# EAGLE schematic BT-2 (EAGLE 9.6.2)
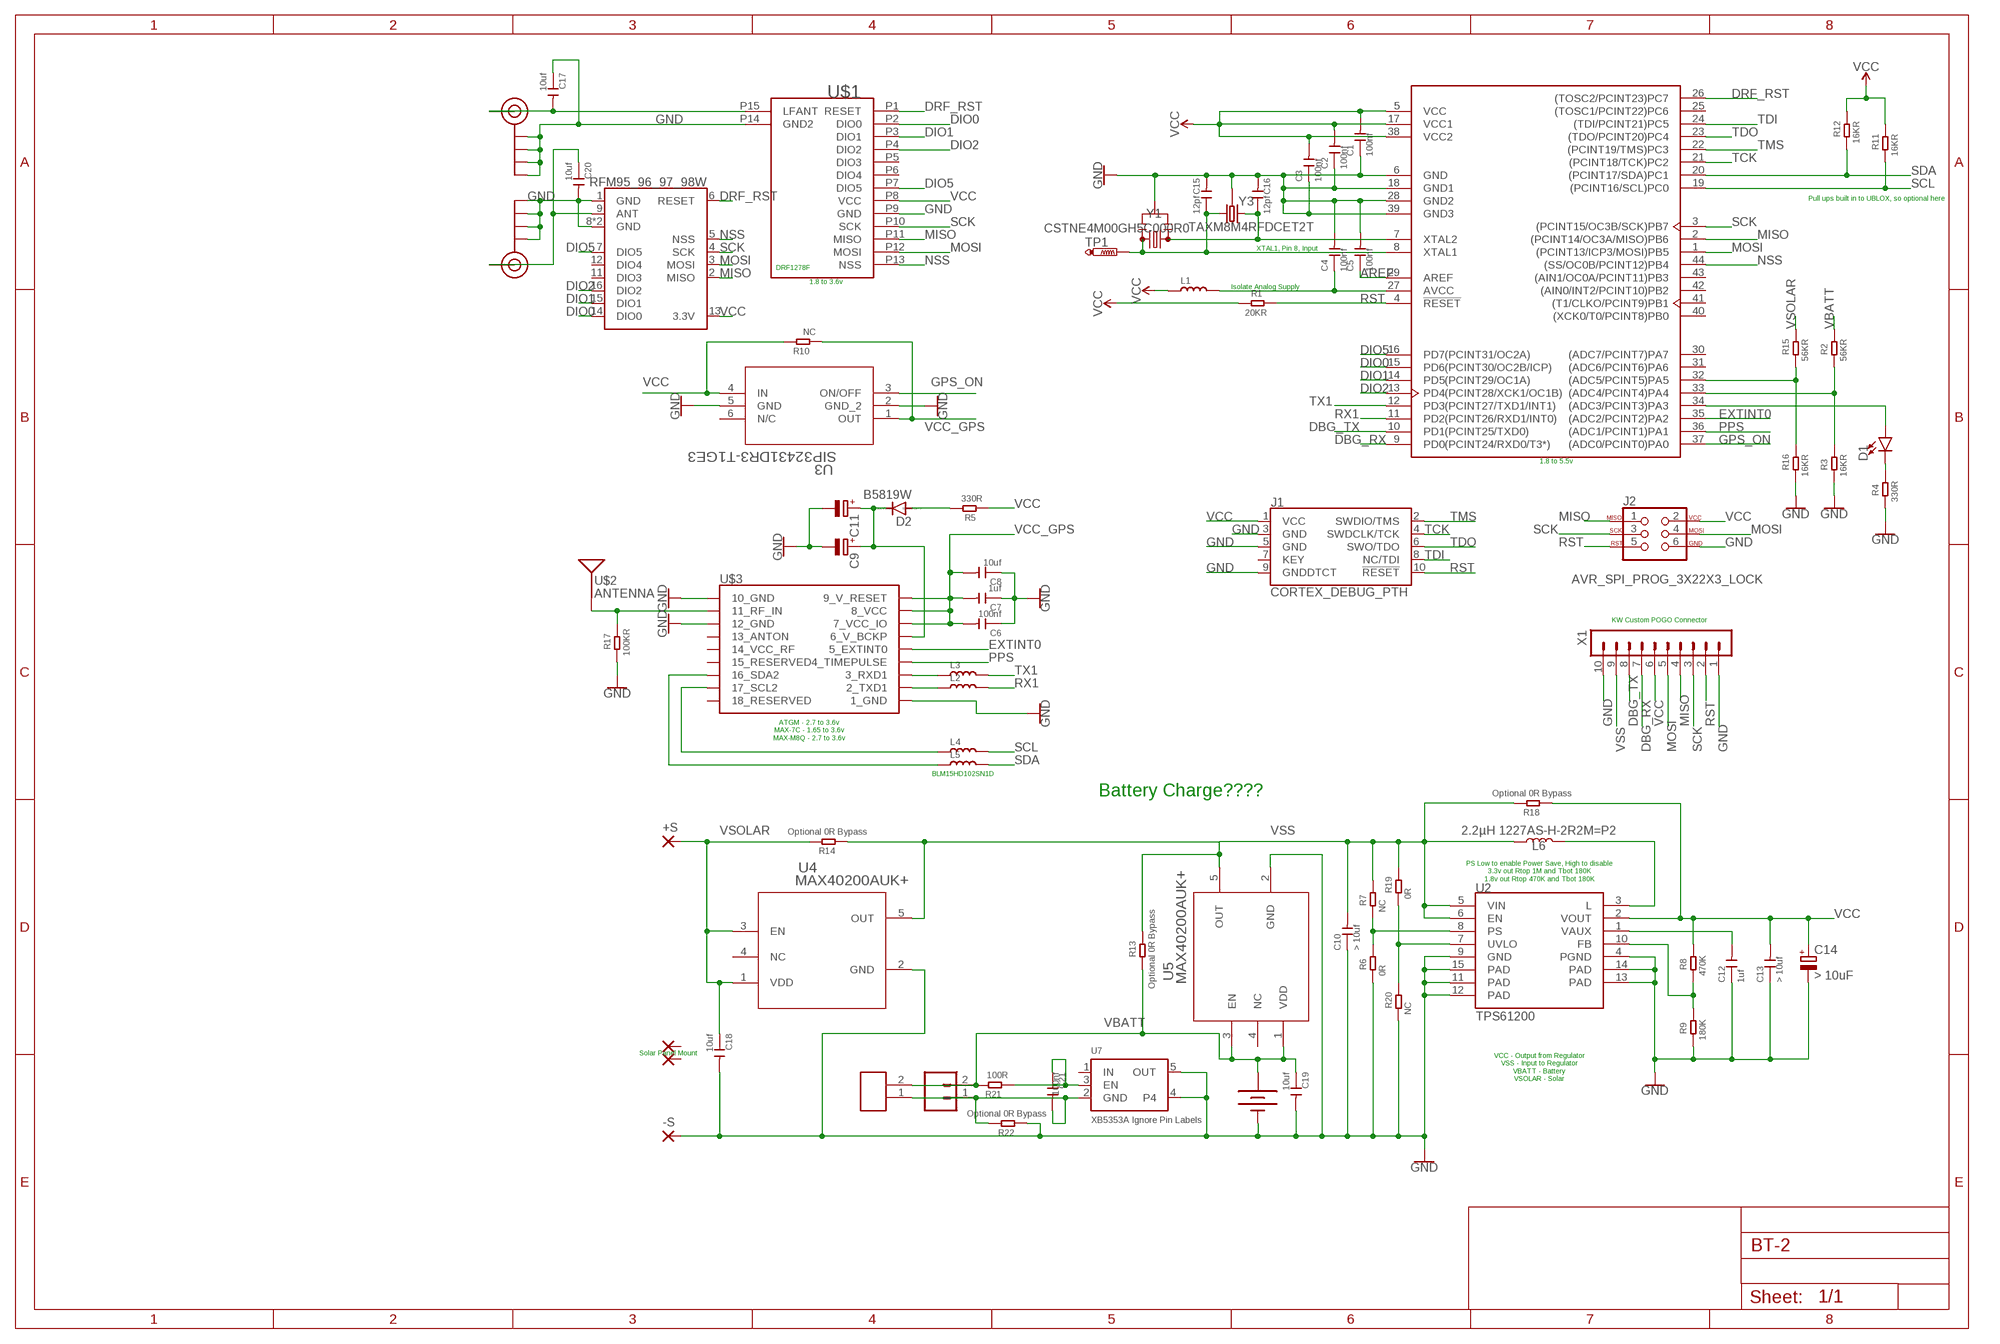
[diagram p0: schematic, sheet 1]

## Parts
+S  SMD2  [SMD1,27-2,54]
-S  SMD2  [SMD1,27-2,54]
BT1  BATTERY  [BATTERY-AA-AAA]
C1  100nf  CERAMIC-100NF-25V-10%-X7R(0402)  [C0402]
C2  100nf  CERAMIC-100NF-25V-10%-X7R(0402)  [C0402]
C3  100nf  CERAMIC-100NF-25V-10%-X7R(0402)  [C0402]
C4  100nf  CERAMIC-100NF-25V-10%-X7R(0402)  [C0402]
C5  100nf  CERAMIC-100NF-25V-10%-X7R(0402)  [C0402]
C6  100nf  CERAMIC-100NF-25V-10%-X7R(0402)  [C0402]
C7  1uf  CERAMIC-1UF-10V-10%-X5R(0402)  [C0402]
C8  10uf  CERAMIC-10UF-6.3V-20%-X5R(0402)  [C0402]
C9  RCL_CPOL-EUSMCC  [RCL_SMC_C]
C10  > 10uf  CERAMIC-10UF-10V-10%-X5R(0603)  [C0603]
C11  C-POL_ECAP-10.5MM  [CAPAE1030X1050N]
C12  1uf  CERAMIC-1UF-10V-10%-X5R(0402)  [C0402]
C13  > 10uf  CERAMIC-10UF-10V-10%-X5R(0603)  [C0603]
C14  > 10uF  RCL_CPOL-EUSMCC  [RCL_SMC_C]
C15  12pf  CERAMIC-100NF-25V-10%-X7R(0402)  [C0402]
C16  12pf  CERAMIC-100NF-25V-10%-X7R(0402)  [C0402]
C17  10uf  CERAMIC-10UF-6.3V-20%-X5R(0402)  [C0402]
C18  10uf  CERAMIC-10UF-6.3V-20%-X5R(0402)  [C0402]
C19  10uf  CERAMIC-10UF-6.3V-20%-X5R(0402)  [C0402]
C20  10uf  CERAMIC-10UF-6.3V-20%-X5R(0402)  [C0402]
C21  100nf  CERAMIC-100NF-25V-10%-X7R(0402)  [C0402]
D1  LED0603  [LED-0603]
D2  B5819W  DIODE-SOD123  [SOD123]
J1  CORTEX_DEBUG_PTH  [2X5-PTH-1.27MM]
J2  AVR_SPI_PROG_3X22X3_LOCK  [2X3_LOCK]
J3  JST_ZH_2PIN  [JST_ZH_2PIN]
J4  CONN_02JST-PTH-2-KIT  [JST-2-PTH-KIT]
J$1  SMA_EDGE  [SMA-EDGE]
J$2  SMA_EDGE  [SMA-EDGE]
L1  BLM15HD102SN1D  SMD-INDUCTOR-3.3NH-0.3NH-300MA(0402)  [L0402]
L2  BLM15HD102SN1D  SMD-INDUCTOR-3.3NH-0.3NH-300MA(0402)  [L0402]
L3  BLM15HD102SN1D  SMD-INDUCTOR-3.3NH-0.3NH-300MA(0402)  [L0402]
L4  BLM15HD102SN1D  SMD-INDUCTOR-3.3NH-0.3NH-300MA(0402)  [L0402]
L5  BLM15HD102SN1D  SMD-INDUCTOR-3.3NH-0.3NH-300MA(0402)  [L0402]
L6  2.2µH 1227AS-H-2R2M=P2  INDUCTOR-CDRH-4.7UH  [INDUCTOR_4.7UH]
NC1  SMD2  [SMD1,27-2,54]
NC2  SMD2  [SMD1,27-2,54]
R1  20KR  SMD-RES-20K-5%-1/16W(0402)  [R0402]
R2  56KR  SMD-RES-20K-5%-1/16W(0402)  [R0402]
R3  16KR  SMD-RES-20K-5%-1/16W(0402)  [R0402]
R4  330R  SMD-RES-20K-5%-1/16W(0402)  [R0402]
R5  330R  SMD-RES-20K-5%-1/16W(0402)  [R0402]
R6  0R  SMD-RES-20K-5%-1/16W(0402)  [R0402]
R7  NC  SMD-RES-20K-5%-1/16W(0402)  [R0402]
R8  470K  SMD-RES-20K-5%-1/16W(0402)  [R0402]
R9  180K  SMD-RES-20K-5%-1/16W(0402)  [R0402]
R10  NC  SMD-RES-20K-5%-1/16W(0402)  [R0402]
R11  16KR  SMD-RES-20K-5%-1/16W(0402)  [R0402]
R12  16KR  SMD-RES-20K-5%-1/16W(0402)  [R0402]
R13  Optional 0R Bypass  SMD-RES-20K-5%-1/16W(0402)  [R0402]
R14  Optional 0R Bypass  SMD-RES-20K-5%-1/16W(0402)  [R0402]
R15  56KR  SMD-RES-20K-5%-1/16W(0402)  [R0402]
R16  16KR  SMD-RES-20K-5%-1/16W(0402)  [R0402]
R17  100KR  SMD-RES-20K-5%-1/16W(0402)  [R0402]
R18  Optional 0R Bypass  SMD-RES-20K-5%-1/16W(0402)  [R0402]
R19  0R  SMD-RES-20K-5%-1/16W(0402)  [R0402]
R20  NC  SMD-RES-20K-5%-1/16W(0402)  [R0402]
R21  100R  SMD-RES-20K-5%-1/16W(0402)  [R0402]
R22  Optional 0R Bypass  SMD-RES-20K-5%-1/16W(0402)  [R0402]
TP1  TESTPAD_PTR1TP10R  [TESTPAD_TP10R]
U1  ATMEGA1284P-AU  [TQFP-44]
U2  TPS61200  [QFN-10_PAD]
U3  SIP32431DR3-T1GE3  [SC-70-6_VIS]
U4  MAX40200AUK+  RAJX_V4.5_REVA_MAX40200AUK+  [RAJX_V4.5_REVA_21-0057F_MXM]
U5  MAX40200AUK+  RAJX_V4.5_REVA_MAX40200AUK+  [RAJX_V4.5_REVA_21-0057F_MXM]
U6  RFM95_96_97_98W  RFM69HCW-433  [RFM69HCW-XXXS2]
U7  XB5353A Ignore Pin Labels  VREG_SOT23-5  [SOT23-5:1]
U$1  DRF1278F_2NO_PINS  [DRF1278F_2_NO_PINS]
U$2  ANTENNA  [ANT-GPS-3X10MM]
U$3  AVA_UBLOX_MAX-6  [AVA_UBLOX_MAX-6]
X1  KEW_HF_V13_M_1R10KW_50MIL-H  [KEW_HF_V13_M_1R09_50MIL-H]
Y1  CSTNE4M00GH5C000R0  SPARKFUN-CLOCKS-KW_RESONATOR-8MHZSMD_3.2X1.3  [SPARKFUN-CLOCKS-KW_RESONATOR-SMD-3.2X1.3]
Y3  TAXM8M4RFDCET2T  CRYSTAL-GROUNDEDSMD-3.2X2.5  [CRYSTAL-SMD-3.2X2.5MM]

## Nets
AREF: C5.1 U1.29(AREF)
DBG_RX: U1.9(PD0(PCINT24/RXD0/T3*)) X1.7
DBG_TX: U1.10(PD1(PCINT25/TXD0)) X1.8
DIO0: U1.15(PD6(PCINT30/OC2B/ICP)) U6.14(DIO0) U$1.P2(DIO0)
DIO1: U1.14(PD5(PCINT29/OC1A)) U6.15(DIO1) U$1.P3(DIO1)
DIO2: U1.13(PD4(PCINT28/XCK1/OC1B)) U6.16(DIO2) U$1.P4(DIO2)
DIO5: U1.16(PD7(PCINT31/OC2A)) U6.7(DIO5) U$1.P7(DIO5)
DRF_RST: U1.26((TOSC2/PCINT23)PC7) U6.6(RESET) U$1.P1(RESET)
EXTINT0: U1.35((ADC2/PCINT2)PA2) U$3.5_EXTINT0
GND: -S.1(P) BT1.P$2(-) BT1.P$4(-) BT1.P$7(-) BT1.P$8(-) C1.1 C2.1 C3.1 C4.2 C5.2 C6.1 C7.1 C8.1 C9.- C10.1 C11.2(-) C12.1 C13.1 C14.- C15.2 C16.2 C17.1 C18.2 C19.2 C20.2 J1.3(GND) J1.5(GND) J1.9(GNDDTCT) J2.6 J$1.GND@0(GND) J$1.GND@1(GND) J$1.GND@2(GND) J$1.GND@3(GND) J$2.GND@0(GND) J$2.GND@1(GND) J$2.GND@2(GND) J$2.GND@3(GND) R3.1 R4.1 R6.1 R9.1 R16.1 R17.1 R20.1 R22.1 U1.6(GND) U1.18(GND1) U1.28(GND2) U1.39(GND3) U2.4(PGND) U2.9(GND) U2.11(PAD) U2.12(PAD) U2.13(PAD) U2.14(PAD) U2.15(PAD) U3.2(GND_2) U3.5(GND) U4.2(GND) U5.2(GND) U6.1(GND) U6.8(GND) U6.10(GND) U7.4 U7.5(OUT) U$1.P9(GND) U$1.P14(GND2) U$3.1_GND U$3.10_GND U$3.12_GND X1.1 X1.10 Y1.2 Y3.2 Y3.4
GPS_ON: U1.37((ADC0/PCINT0)PA0) U3.3(ON/OFF)
MISO: J2.1 U1.2((PCINT14/OC3A/MISO)PB6) U6.2(MISO) U$1.P11(MISO) X1.4
MOSI: J2.4 U1.1((PCINT13/ICP3/MOSI)PB5) U6.3(MOSI) U$1.P12(MOSI) X1.5
N$1: C17.2 J$1.SIG(SIGNAL) U$1.P15(LFANT)
N$2: R19.1 R20.2 U2.7(UVLO)
N$3: C15.1 TP1.TP U1.8(XTAL1) Y1.3 Y3.3
N$4: C16.1 U1.7(XTAL2) Y1.1 Y3.1
N$5: R2.1 R3.2 U1.33((ADC4/PCINT4)PA4)
N$6: C4.1 L1.2 U1.27(AVCC)
N$7: R15.1 R16.2 U1.32((ADC5/PCINT5)PA5)
N$8: D1.A U1.34((ADC3/PCINT3)PA3)
N$9: D1.C R4.2
N$10: R17.2 U$2.SIG(SIGNAL) U$3.11_RF_IN
N$11: C9.+ C11.1(+) D2.C U$3.6_V_BCKP
N$12: L3.1 U$3.3_RXD1
N$13: L2.1 U$3.2_TXD1
N$14: L4.1 U$3.17_SCL2
N$15: L5.1 U$3.16_SDA2
N$16: D2.A R5.2
N$17: R6.2 R7.1 U2.8(PS)
N$18: C12.2 U2.1(VAUX)
N$19: R8.1 R9.2 U2.10(FB)
N$20: C21.1 R21.1 U7.3(EN)
N$21: L6.P$2 U2.3(L)
N$23: C20.1 J$2.SIG(SIGNAL) U6.9(ANT)
N$25: C21.2 J3.1 J4.1 R22.2 U7.2(GND)
NSS: U1.44((SS/OC0B/PCINT12)PB4) U6.5(NSS) U$1.P13(NSS)
PPS: U1.36((ADC1/PCINT1)PA1) U$3.4_TIMEPULSE
RST: J1.10(!RESET) J2.5 R1.2 U1.4(!RESET) X1.2
RX1: L2.2 U1.11(PD2(PCINT26/RXD1/INT0))
SCK: J2.3 U1.3((PCINT15/OC3B/SCK)PB7) U6.4(SCK) U$1.P10(SCK) X1.3
SCL: L4.2 R11.1 U1.19((PCINT16/SCL)PC0)
SDA: L5.2 R12.1 U1.20((PCINT17/SDA)PC1)
TCK: J1.4(SWDCLK/TCK) U1.21((PCINT18/TCK)PC2)
TDI: J1.8(NC/TDI) U1.24((TDI/PCINT21)PC5)
TDO: J1.6(SWO/TDO) U1.23((TDO/PCINT20)PC4)
TMS: J1.2(SWDIO/TMS) U1.22((PCINT19/TMS)PC3)
TX1: L3.2 U1.12(PD3(PCINT27/TXD1/INT1))
VBATT: BT1.P$1(+) BT1.P$3(+) BT1.P$5(+) BT1.P$6(+) C19.1 J3.2 J4.2 R2.2 R13.1 R21.2 U5.1(VDD) U5.3(EN)
VCC: C1.2 C2.2 C3.2 C13.2 C14.+ J1.1(VCC) J2.2 L1.1 R1.1 R5.1 R8.2 R10.2 R11.2 R12.2 R18.1 U1.5(VCC) U1.17(VCC1) U1.38(VCC2) U2.2(VOUT) U3.4(IN) U6.13(3.3V) U$1.P8(VCC) X1.6
VCC_GPS: C6.2 C7.2 C8.2 R10.1 U3.1(OUT) U$3.7_VCC_IO U$3.8_VCC U$3.9_V_RESET
VSOLAR: +S.1(P) C18.1 R14.2 R15.2 U4.1(VDD) U4.3(EN)
VSS: C10.2 L6.P$1 R7.2 R13.2 R14.1 R18.2 R19.2 U2.5(VIN) U2.6(EN) U4.5(OUT) U5.5(OUT) X1.9
Unconnected: J1.7(KEY) NC1.1(P) NC2.1(P) U1.25((TOSC1/PCINT22)PC6) U1.30((ADC7/PCINT7)PA7) U1.31((ADC6/PCINT6)PA6) U1.40((XCK0/T0/PCINT8)PB0) U1.41((T1/CLKO/PCINT9)PB1) U1.42((AIN0/INT2/PCINT10)PB2) U1.43((AIN1/OC0A/PCINT11)PB3) U3.6(N/C) U4.4(NC) U5.4(NC) U6.11(DIO3) U6.12(DIO4) U$1.P5(DIO3) U$1.P6(DIO4) U$3.13_ANTON U$3.14_VCC_RF U$3.15_RESERVED U$3.18_RESERVED

## Notes on the sheet
- Pull ups built in to UBLOX, so optional here
- XTAL1, Pin 8, Input
- DRF1278F
- 1.8 to 3.6v
- Isolate Analog Supply
- 1.8 to 5.5v
- KW Custom POGO Connector
- ATGM - 2.7 to 3.6v
  MAX-7C - 1.65 to 3.6v
  MAX-M8Q - 2.7 to 3.6v
- BLM15HD102SN1D
- Battery Charge????
- PS Low to enable Power Save, High to disable
  3.3v out Rtop 1M and Tbot 180K
  1.8v out Rtop 470K and Tbot 180K
- Solar Panel Mount
- VCC - Output from Regulator
  VSS - Input to Regulator
  VBATT - Battery
  VSOLAR - Solar

## Power pins joined to a net without a drawn wire
IN: U7.1(IN)

## Library data of the parts
+S -S NC1 NC2 = wirepad:SMD2: SMD PAD
BT1 = Dual AA and AAA - RS Keystone 55 and 53 SMD:BATTERY: Battery - Single Cell A variety of battery chemistries, sizes, and footprints. Device List: 20MM_PTH - Coin Cell Battery Holder - 20mm (PTH) <https://www.sparkfun.com/products/783> 6.8MM_PTH - Coin Cell Battery Holder - 6.8MM(SMD) <https://www.digikey.com/product-detail/en/seiko-instruments/MS621FE-FL11E/728-1057-ND/1889208?WT.srch=1&gclid=CNOQ5a6LzdQCFZS2wAodXCkE0g> 12MM_SMD - Coin Cell Battery Holder - 12mm (SMD) <https://www.sparkfun.com/products/10592> 12MM_PTH - Coin Cell Battery Holder - 12mm (PTH) <https://www.sparkfun.com/products/7948> 20MM_SMD - 20mm Coin Cell Battery Holder (SMD) (2 legs) Used on the Big Time Watch Kit <https://www.sparkfun.com/products/11734> 20MM_SMD_4LEGS - Coin Cell Battery Holder - 20mm (SMD) <https://www.sparkfun.com/products/11892> 20MM_SMD_4LEGS_OVERPASTE - Coin Cell Battery Holder - 20mm (SMD) <https://www.sparkfun.com/products/11892> (Over-paste on the legs) 24.5MM_PTH - Coin Cell Battery Holder - 24.5mm (PTH) <https://www.sparkfun.com/products/8863> 9V - 9V Battery Holder - PC Mount Used on the SparkFun SparkPunk Sound Kit <https://www.sparkfun.com/products/11177> and SparkFun SparkPunk Sequencer Kit <https://www.sparkfun.com/products/12707> 18650 - Battery Holder - 18650 (PTH) <https://www.sparkfun.com/products/13113> AA - Battery Holder - 1xAA (PTH) <https://www.sparkfun.com/products/7949> AAA - Battery Holder - 1xAAA (PTH) <https://www.sparkfun.com/products/12718> AA_KIT - Battery Holder - 1xAA (PTH) <https://www.sparkfun.com/products/7949> Special kit package - pads only have exposed copper on one side of the board. AAA_KIT - Battery Holder - 1xAAA (PTH) <https://www.sparkfun.com/products/12718> Special kit package - pads only have exposed copper on one side of the board.
C1-C6 C21 = OPL_Capacitor:CERAMIC-100NF-25V-10%-X7R(0402): 302010024; MPN: CC0402KRX7R8BB104
C7 C12 = OPL_Capacitor:CERAMIC-1UF-10V-10%-X5R(0402): 302010040; MPN: CC0402KRX5R6BB105
C8 C17-C20 = OPL_Capacitor:CERAMIC-10UF-6.3V-20%-X5R(0402): 302010053; MPN: CC0402MRX5R5BB106
C9 C14 = KEW_HF_V16:RCL_CPOL-EU: POLARIZED CAPACITOR, European symbol
C10 C13 = OPL_Capacitor:CERAMIC-10UF-10V-10%-X5R(0603): 302010103; MPN: CC0603KRX5R6BB106; VALUE: 10uf
C11 = Capacitor:C-POL: Capacitor Polarised - Generic; CATEGORY: Capacitor
C15 C16 = OPL_Capacitor:CERAMIC-100NF-25V-10%-X7R(0402): 302010024; MPN: CC0402KRX7R8BB104; VALUE: 100nf
D1 = SparkFun-LED:LED: LED (Generic) Standard schematic elements and footprints for 5mm, 3mm, 1206, and 0603 sized LEDs. Generic LEDs with no color specified.
D2 = diode:DIODE-: DIODE
J1 = SparkFun-Connectors:CORTEX_DEBUG: Cortex Debug Connector - 10 pin Supports JTAG debug, Serial Wire debug, and Serial Wire Viewer. PTH and SMD connector options available. General Connector Information <http://infocenter.arm.com/help/topic/com.arm.doc.faqs/attached/13634/cortex_debug_connectors.pdf> Products: PTH Connector <http://www.digikey.com/product-detail/en/cnc-tech/3220-10-0100-00/1175-1627-ND/3883661> -via Digi-Key SparkFun PSoc <https://www.sparkfun.com/products/13229> SparkFun T <https://www.sparkfun.com/products/13810>
J2 = SparkFun-Connectors:AVR_SPI_PROG_3X2: AVR ISP 6 Pin This is the reduced ISP connector for AVR programming. Common on Arduino. This footprint will take up less PCB space and can be used with a 10-pin to 6-pin adapter such as SKU: BOB-08508 **Special note about "TEST_POINT" package. The stop mask is on the top side, so if you want your programming test points to be on the bottom of your board, make sure to place this package on the bottom side of the board. This also ensure that the orientation to program from the bottom side will be correct. SparkFun Products: SparkFun ISP Pogo Adapter <https://www.sparkfun.com/products/11591> - NS Tiny AVR Programmer <https://www.sparkfun.com/products/11801> -PTH
J3 = ESP32-Cam-Pico-V4:JST_ZH_2PIN: JST ZH connector, 2 pins ZH has 1.5mm spacing. Datasheet <http://www.jst-mfg.com/product/pdf/eng/eZH.pdf>
J4 = ESP32-Cam-Pico-V4:CONN_02: Multi connection point. Often used as Generic Header-pin footprint for 0.1 inch spaced/style header connections On any of the 0.1 inch spaced packages, you can populate with these: Break Away Headers - Straight <https://www.sparkfun.com/products/116> (PRT-00116) Break Away Male Headers - Right Angle <https://www.sparkfun.com/products/553> (PRT-00553) Female Headers <https://www.sparkfun.com/products/115> (PRT-00115) Break Away Headers - Machine Pin <https://www.sparkfun.com/products/117> (PRT-00117) Break Away Female Headers - Swiss Machine Pin <https://www.sparkfun.com/products/743> (PRT-00743) For SCREWTERMINALS and SPRING TERMINALS visit here: Screw Terimnals on SparkFun.com <https://www.sparkfun.com/search/results?term=Screw+Terminals> (5mm/3.5mm/2.54mm spacing) This device is also useful as a general connection point to wire up your design to another part of your project. Our various solder wires solder well into these plated through hole pads. Hook-Up Wire - Assortment (Stranded, 22 AWG) <https://www.sparkfun.com/products/11375> (PRT-11375) Hook-Up Wire - Assortment (Solid Core, 22 AWG) <https://www.sparkfun.com/products/11367> (PRT-11367) View the entire wire category on our website here <https://www.sparkfun.com/categories/141> Special notes: Molex polarized connector foot print use with: PRT-08233 with associated crimp pins and housings. 2.54_SCREWTERM for use with PRT-10571. 3.5mm Screw Terminal footprints for PRT-08084 5mm Screw Terminal footprints for use with PRT-08432; PROD_ID: CONN-13512; SF_ID: PRT-09918; SF_SKU: PRT-08432; SKU: PRT-09914; STOREFRONT_SKU: PRT-15898
J$1 J$2 = ESP32-Cam-Pico-V4:SMA_EDGE: SMA Antenna Connector End launch SMA connector. The paste layer has been removed so that the connector can be hand soldered onto the board after reflow.
L1-L5 = OPL_Inductor:SMD-INDUCTOR-3.3NH-0.3NH-300MA(0402): 303010056; VALUE: 3.3NH- 300MA
L6 = SparkFun-Coils:INDUCTOR: Inductors Resist changes in electrical current. Basically a coil of wire. SparkFun Products: SparkFun Load Cell Amplifier - HX711 <https://www.sparkfun.com/products/13879> IOIO-OTG - V2.2 <https://www.sparkfun.com/products/13613>; PROD_ID: NDUC-10146; VALUE: 4.7µH/±30%/1.2A
R1-R5 R7-R18 R20-R22 = OPL_Resistor:SMD-RES-20K-5%-1/16W(0402): 301012018; MPN: RC0402JR-070RL; VALUE: 0R
R6 R19 = OPL_Resistor:SMD-RES-20K-5%-1/16W(0402): 301012018; MPN: RC0402JR-070RL
TP1 = KEW_HF_V16:TESTPAD_PTR1: TEST PIN
U1 = Microcontroller:ATMEGA1284P-AU: IC MCU 8BIT 128KB FLASH 44TQFP Manufacturer's datasheet <http://ww1.microchip.com/downloads/en/DeviceDoc/ATmega164A_PA-324A_PA-644A_PA-1284_P_Data-Sheet-40002070A.pdf>; CREATED_BY: PCBLayout.com; DIGIKEY_PART_NUMBER: ATMEGA1284P-AU-ND; MANUFACTURER: Microchip Technology; MPN: ATMEGA1284P-AU; PACKAGE: TQFP-44
U2 = SparkFun-IC-Power:TPS61200: DC to DC Booster IC-10035; PROD_ID: IC-10035
U3 = SIP32431DR3T1GE3:SIP32431DR3-T1GE3; BUILT_BY: EMA_Anthony; COPYRIGHT: Copyright (C) 2018 Accelerated Designs. All rights reserved; DATASHEET: VY1332M51Y5UC63V0; MANUFACTURER_PART_NUMBER: SIP32431DR3-T1GE3; SOURCELIBRARY: Vishay_2019-11-13; VENDOR: Vishay
U4 U5 = KEW_HF_V16:RAJX_V4.5_REVA_MAX40200AUK+; BUILT_BY: EMA_UL_Team; COPYRIGHT: Copyright (C) 2018 Accelerated Designs. All rights reserved; MANUFACTURER_PART_NUMBER: MAX40200AUK+; SOURCELIBRARY: Maxim_2018-11-30; VENDOR: Maxim Integrated Products
U6 = SparkFun-RF:RFM69H: Hope RF RFM69H ISM Transceiver Module The RFM69H is a transceiver module capable of operation over a wide frequency range, including the 315,433,868 and 915MHz license-free ISM (Industry Scientific and Medical) frequency bands. All major RF communication parameters are programmable and most of them can be dynamically set. The RFM69H offers the unique advantage of programmable narrow-band and wide- band communication modes. The RFM69H is optimized for low power consumption while offering high RF output power and channelized operation.Compliance ETSI and FCC regulations. Datasheet <http://www.hoperf.cn/upload/docs/RF/SX/RFM69H_DataSheet_v1.3.pdf> SparkFun Products RFM69HCW Wireless Transceiver - 915MHz <https://www.sparkfun.com/products/13909> (COM-13909) RFM69HCW Wireless Transceiver - 434MHz <https://www.sparkfun.com/products/13910> (COM-13910) SparkFun RFM69 Breakout (915MHz) <https://www.sparkfun.com/products/12775> (WRL-12775) SparkFun RFM69 Breakout (434MHz) <https://www.sparkfun.com/products/12823> (WRL-12823); PROD_ID: IC-12053; VALUE: 433MHz
U7 = Airquality_Sensor:VREG_SOT23-5: SOT23-5 Fixed Voltage Regulators Part Current Out V Out V In V Dropout θJA (°C/W) TJ (°C) Digikey Part No. ADP121 150mA 3.3V 3.4-5.5V 0.09V @ 150mA -- -- ADP121-AUJZ33R7CT-ND ADP121 150mA 3.0V 3.1-5.5V 0.09V @ 150mA -- -- ADP121-AUJZ30R7CT-ND ADP122 300mA 3.3V 3.4-5.5V 0.085V @ 300mA -- -- ADP122AUJZ-3.3-R7CT-ND ADP1712 300mA 3.3V 3.5-5.5V 0.17V @ 300mA -- -- ADP1712AUJZ-3.3-R7TR-ND AP7311 (Low Cost) 150mA 3.3V 3.5-6V 0.15V @ 150mA -- -- AP7311-33WG-7DICT-ND LD39015M18R 150mA 1.8V 1.9V-5.5V 0.08V @ 100mA -- -- 497-6977-1-ND LP2985A-33DBVR 150mA 3.3V 3.3-16V 0.28V @ 150mA 206 150 296-18479-1-ND MCP1824T-3302E/OT 300mA 3.3V 3.5V-6V 0.2V @ 300mA -- -- MCP1824T-3302E/OTCT-ND MIC5205-2.5YM5 TR 150mA 2.5V 2.7-16V 0.165V @ 150mA -- -- 576-1257-2-ND MIC5205-3.0YM5 TR 150mA 3.0V 3.2V-16V 0.165V @ 150mA -- -- 576-1258-2-ND MIC5205-3.3YM5 TR 150mA 3.3V 3.5V-16V 0.165V @ 150mA -- -- 576-1259-2-ND TPS780330220 150mA 3.3V+2.2V 3.6-5.5V 250mV Max -- -- 296-23332-1-ND TDA3663/N1,135 100mA 3.3V 3.5-45V 0.18V @ 50mA -- -- 568-5343-1-ND Max operating temp can be calculated using θJA, TJ (max junction temperature), and power in watts. Set the "Maximum Ambient Temperature" until it reaches TJ ("Max Junction Temperature"), which is the absolute limit for safe use of the regulator: Heat Sink Temperature Calculator <http://www.daycounter.com/Calculators/Heat-Sink-Temperature-Calculator.phtml> For example, With 12V source into a 3.3V LP2985 and a 30mA load, we are dissipating (12V-3.3V) * 0.03A = 0.261W. With a θJA of 206 °C/W, a TJ of 150°C, and 261mW we can safely use the chip without a heat sink up to 75°C (=147.1°C Junction Temperature).
U$1 = DRF1278F:DRF1278F_2
U$2 = GPS Antenna RainSun GPS1003-1575:ANTENNA: Single-ended Antennae 1.575GHz antennae with just one terminal. These are all chip antennae. 1575MHz (GPS) Antennae ANT-GPS-2X7MM - 2.0 x 7.0 mm chip antenna. (SparkFun Product <https://www.sparkfun.com/products/9131>) ANT-GPS-2X8MM - 2.0 x 8.0 mm chip antenna. (SparkFun Product <https://www.sparkfun.com/products/8418>)
U$3 = KEW_HF_V16:AVA_UBLOX_MAX-6: UBLOX MAX-6
X1 = KEW_HF_V16:KEW_HF_V13_M_1R10KW: Pin header, male, 1 row
Y1 = KEW_HF_V16:SPARKFUN-CLOCKS-KW_RESONATOR-8MHZ: 8MHz Resonator Digikey Example <http://www.digikey.com/product-detail/en/murata-electronics-north-america/CSTCE10M0G55-R0/490-1196-1-ND/584633> Frequency: 8MHz Frequency Stability: ±0.2% Frequency Tolerance: ±0.5% Capacitance: 33pF SparkFun Products Arduino Pro Mini 328- 3.3V/8MHz <https://www.sparkfun.com/products/11114> SparkFun Digital Sandbox <https://www.sparkfun.com/products/12651>; PROD_ID: XTAL-08895; VALUE: 8MHz
Y3 = SparkFun-Clocks:CRYSTAL-GROUNDED: Crystals w/ Ground Pin (Generic) These are passive quartz crystals, which can be used as a clock source for a microcontroller. Crystal's are usually two-terminal devices. A third terminal may be optionally connected to ground, as recommended by the manufaturer.